# Altium schematic sheet Sheet_2.schdoc
size 404 x 275 mm
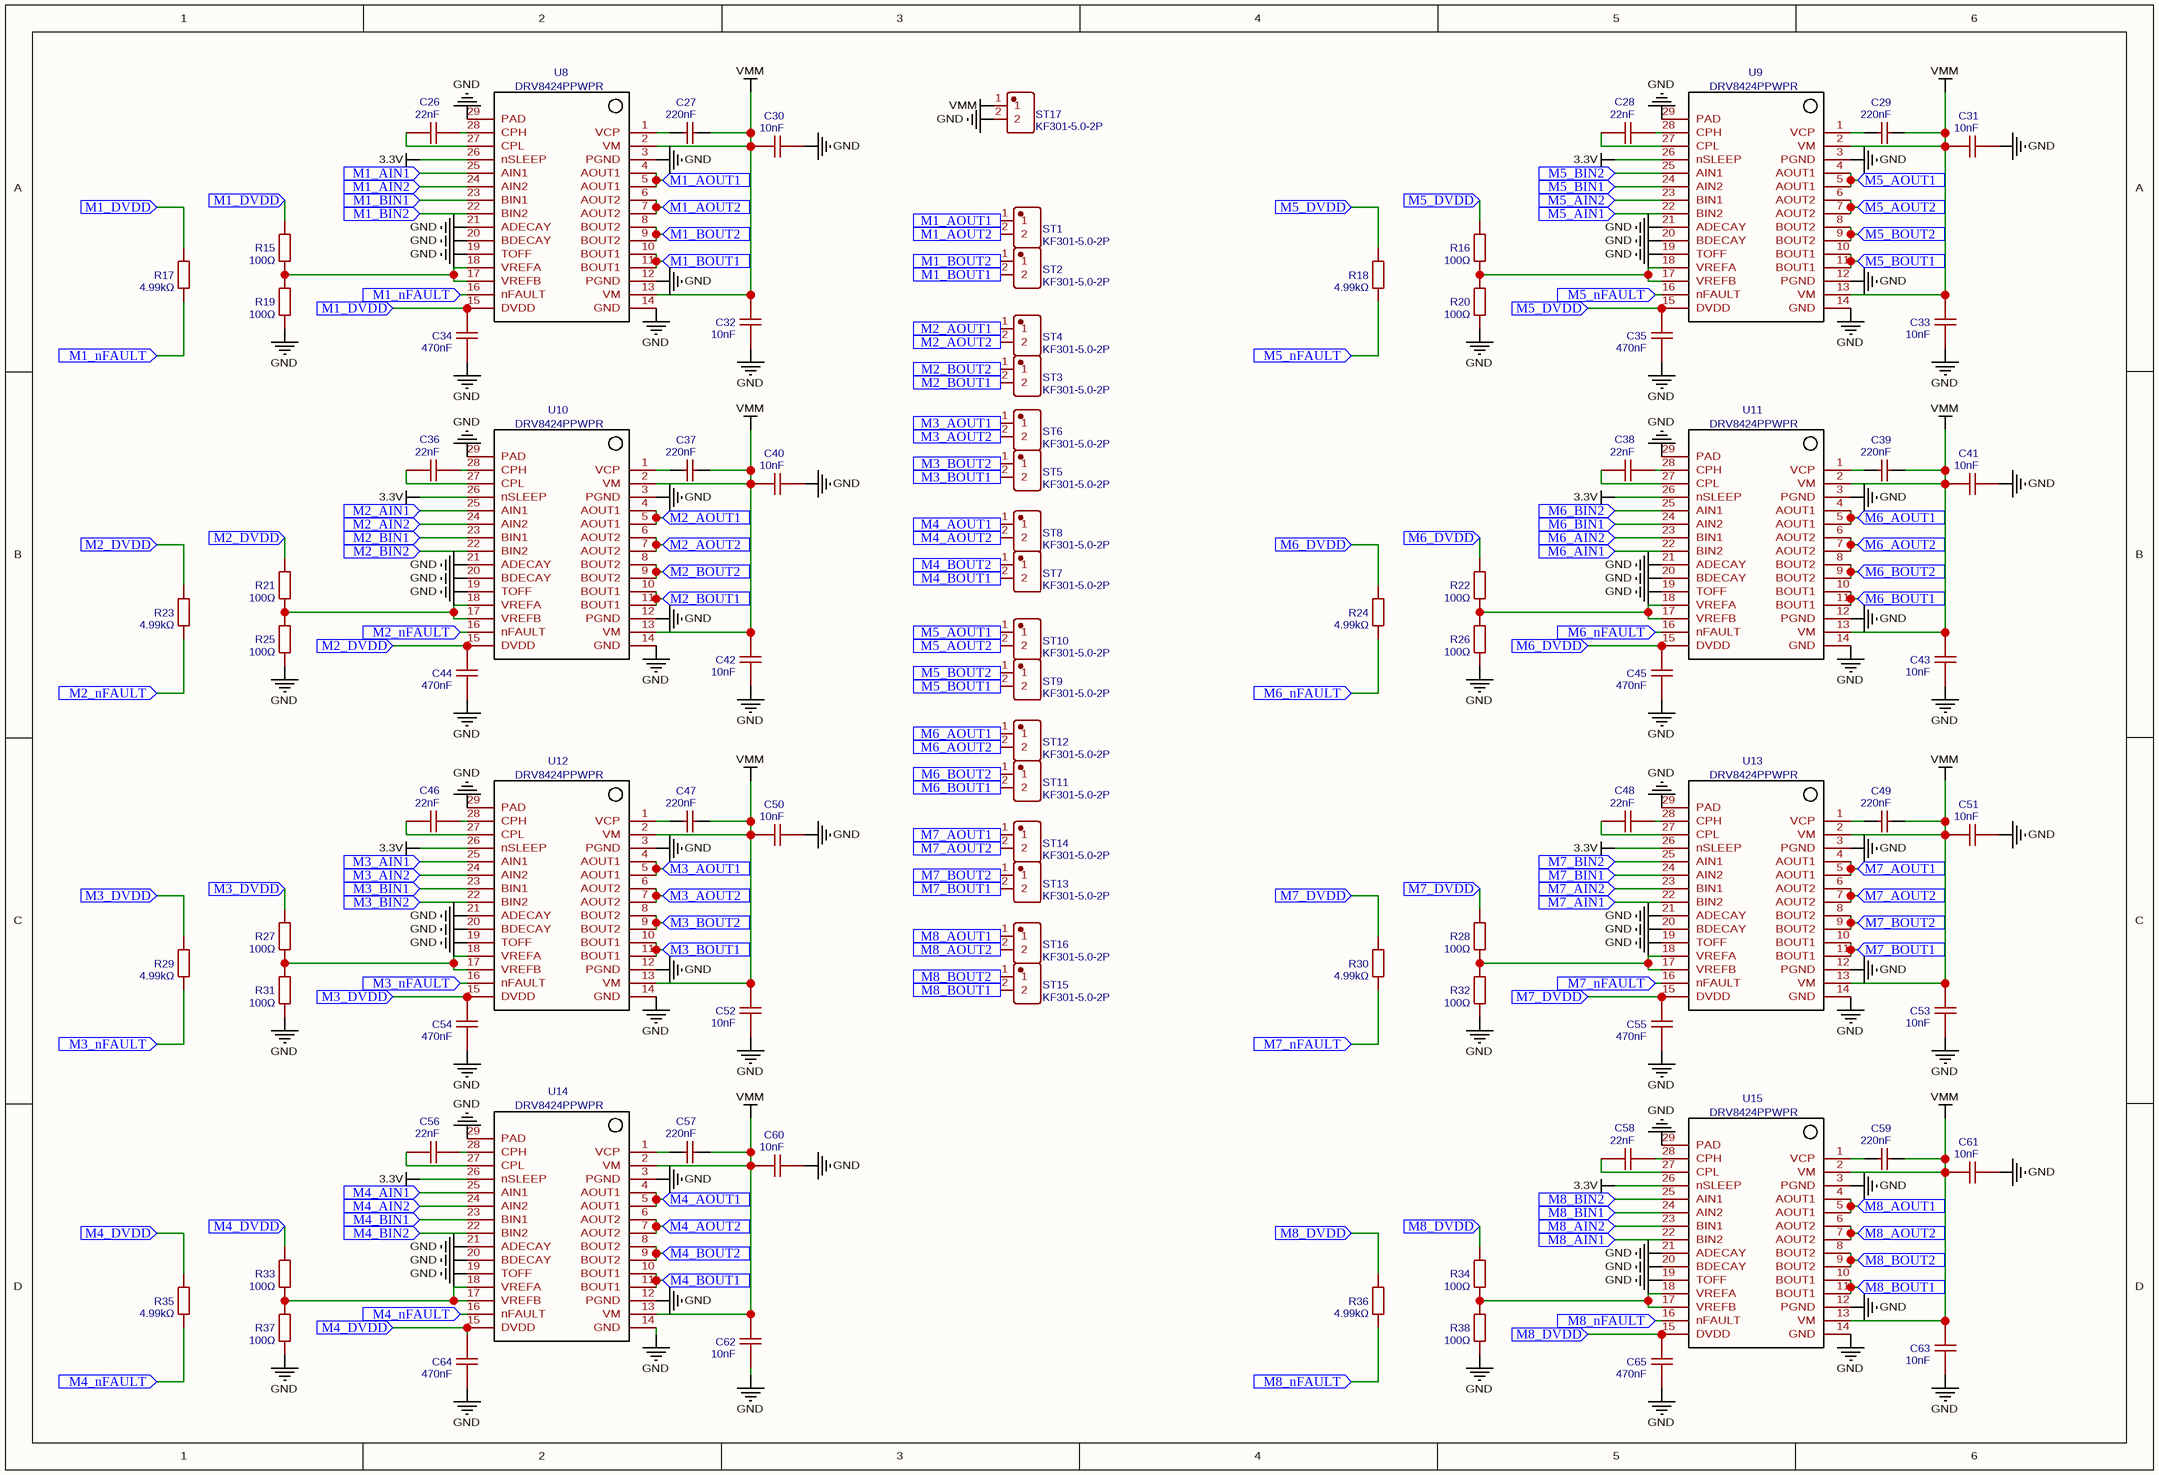
[diagram p0: Sheet_2.schdoc]

## Parts
C26  22nF  [C0805]
C27  220nF  [C0805]
C28  22nF  [C0805]
C29  220nF  [C0805]
C30  10nF  [C0805]
C31  10nF  [C0805]
C32  10nF  [C0805]
C33  10nF  [C0805]
C34  470nF  [C0805]
C35  470nF  [C0805]
C36  22nF  [C0805]
C37  220nF  [C0805]
C38  22nF  [C0805]
C39  220nF  [C0805]
C40  10nF  [C0805]
C41  10nF  [C0805]
C42  10nF  [C0805]
C43  10nF  [C0805]
C44  470nF  [C0805]
C45  470nF  [C0805]
C46  22nF  [C0805]
C47  220nF  [C0805]
C48  22nF  [C0805]
C49  220nF  [C0805]
C50  10nF  [C0805]
C51  10nF  [C0805]
C52  10nF  [C0805]
C53  10nF  [C0805]
C54  470nF  [C0805]
C55  470nF  [C0805]
C56  22nF  [C0805]
C57  220nF  [C0805]
C58  22nF  [C0805]
C59  220nF  [C0805]
C60  10nF  [C0805]
C61  10nF  [C0805]
C62  10nF  [C0805]
C63  10nF  [C0805]
C64  470nF  [C0805]
C65  470nF  [C0805]
R15  100Ω  [R0805]
R16  100Ω  [R0805]
R17  4.99kΩ  [R0805]
R18  4.99kΩ  [R0805]
R19  100Ω  [R0805]
R20  100Ω  [R0805]
R21  100Ω  [R0805]
R22  100Ω  [R0805]
R23  4.99kΩ  [R0805]
R24  4.99kΩ  [R0805]
R25  100Ω  [R0805]
R26  100Ω  [R0805]
R27  100Ω  [R0805]
R28  100Ω  [R0805]
R29  4.99kΩ  [R0805]
R30  4.99kΩ  [R0805]
R31  100Ω  [R0805]
R32  100Ω  [R0805]
R33  100Ω  [R0805]
R34  100Ω  [R0805]
R35  4.99kΩ  [R0805]
R36  4.99kΩ  [R0805]
R37  100Ω  [R0805]
R38  100Ω  [R0805]
ST1  KF301-5.0-2P  [CONN-TH_P5.00_KF301-5.0-2P]
ST2  KF301-5.0-2P  [CONN-TH_P5.00_KF301-5.0-2P]
ST3  KF301-5.0-2P  [CONN-TH_P5.00_KF301-5.0-2P]
ST4  KF301-5.0-2P  [CONN-TH_P5.00_KF301-5.0-2P]
ST5  KF301-5.0-2P  [CONN-TH_P5.00_KF301-5.0-2P]
ST6  KF301-5.0-2P  [CONN-TH_P5.00_KF301-5.0-2P]
ST7  KF301-5.0-2P  [CONN-TH_P5.00_KF301-5.0-2P]
ST8  KF301-5.0-2P  [CONN-TH_P5.00_KF301-5.0-2P]
ST9  KF301-5.0-2P  [CONN-TH_P5.00_KF301-5.0-2P]
ST10  KF301-5.0-2P  [CONN-TH_P5.00_KF301-5.0-2P]
ST11  KF301-5.0-2P  [CONN-TH_P5.00_KF301-5.0-2P]
ST12  KF301-5.0-2P  [CONN-TH_P5.00_KF301-5.0-2P]
ST13  KF301-5.0-2P  [CONN-TH_P5.00_KF301-5.0-2P]
ST14  KF301-5.0-2P  [CONN-TH_P5.00_KF301-5.0-2P]
ST15  KF301-5.0-2P  [CONN-TH_P5.00_KF301-5.0-2P]
ST16  KF301-5.0-2P  [CONN-TH_P5.00_KF301-5.0-2P]
ST17  KF301-5.0-2P  [CONN-TH_P5.00_KF301-5.0-2P]
U8  DRV8424PPWPR  [TSSOP_28_POWERPAD]
U9  DRV8424PPWPR  [TSSOP_28_POWERPAD]
U10  DRV8424PPWPR  [TSSOP_28_POWERPAD]
U11  DRV8424PPWPR  [TSSOP_28_POWERPAD]
U12  DRV8424PPWPR  [TSSOP_28_POWERPAD]
U13  DRV8424PPWPR  [TSSOP_28_POWERPAD]
U14  DRV8424PPWPR  [TSSOP_28_POWERPAD]
U15  DRV8424PPWPR  [TSSOP_28_POWERPAD]

## Ports
M1_AIN1 (in), M1_AIN2 (in), M1_AOUT1 (in), M1_AOUT2 (in), M1_BIN1 (in), M1_BIN2 (in), M1_BOUT1 (in), M1_BOUT2 (in), M1_DVDD (in), M1_nFAULT (in), M2_AIN1 (in), M2_AIN2 (in), M2_AOUT1 (in), M2_AOUT2 (in), M2_BIN1 (in), M2_BIN2 (in), M2_BOUT1 (in), M2_BOUT2 (in), M2_DVDD (in), M2_nFAULT (in), M3_AIN1 (in), M3_AIN2 (in), M3_AOUT1 (in), M3_AOUT2 (in), M3_BIN1 (in), M3_BIN2 (in), M3_BOUT1 (in), M3_BOUT2 (in), M3_DVDD (in), M3_nFAULT (in), M4_AIN1 (in), M4_AIN2 (in), M4_AOUT1 (in), M4_AOUT2 (in), M4_BIN1 (in), M4_BIN2 (in), M4_BOUT1 (in), M4_BOUT2 (in), M4_DVDD (in), M4_nFAULT (in), M5_AIN1 (in), M5_AIN2 (in), M5_AOUT1 (in), M5_AOUT2 (in), M5_BIN1 (in), M5_BIN2 (in), M5_BOUT1 (in), M5_BOUT2 (in), M5_DVDD (in), M5_nFAULT (in), M6_AIN1 (in), M6_AIN2 (in), M6_AOUT1 (in), M6_AOUT2 (in), M6_BIN1 (in), M6_BIN2 (in), M6_BOUT1 (in), M6_BOUT2 (in), M6_DVDD (in), M6_nFAULT (in), M7_AIN1 (in), M7_AIN2 (in), M7_AOUT1 (in), M7_AOUT2 (in), M7_BIN1 (in), M7_BIN2 (in), M7_BOUT1 (in), M7_BOUT2 (in), M7_DVDD (in), M7_nFAULT (in), M8_AIN1 (in), M8_AIN2 (in), M8_AOUT1 (in), M8_AOUT2 (in), M8_BIN1 (in), M8_BIN2 (in), M8_BOUT1 (in), M8_BOUT2 (in), M8_DVDD (in), M8_nFAULT (in)

## Nets
3.3V: U8.26(nSLEEP) U9.26(nSLEEP) U10.26(nSLEEP) U11.26(nSLEEP) U12.26(nSLEEP) U13.26(nSLEEP) U14.26(nSLEEP) U15.26(nSLEEP)
GND: C30.2 C31.2 C32.2 C33.2 C34.2 C35.2 C40.2 C41.2 C42.2 C43.2 C44.2 C45.2 C50.2 C51.2 C52.2 C53.2 C54.2 C55.2 C60.2 C61.2 C62.2 C63.2 C64.2 C65.2 R19.1 R20.1 R25.1 R26.1 R31.1 R32.1 R37.1 R38.1 ST17.2 U8.3(PGND) U8.12(PGND) U8.14(GND) U8.19(TOFF) U8.20(BDECAY) U8.21(ADECAY) U8.29(PAD) U9.3(PGND) U9.12(PGND) U9.14(GND) U9.19(TOFF) U9.20(BDECAY) U9.21(ADECAY) U9.29(PAD) U10.3(PGND) U10.12(PGND) U10.14(GND) U10.19(TOFF) U10.20(BDECAY) U10.21(ADECAY) U10.29(PAD) U11.3(PGND) U11.12(PGND) U11.14(GND) U11.19(TOFF) U11.20(BDECAY) U11.21(ADECAY) U11.29(PAD) U12.3(PGND) U12.12(PGND) U12.14(GND) U12.19(TOFF) U12.20(BDECAY) U12.21(ADECAY) U12.29(PAD) U13.3(PGND) U13.12(PGND) U13.14(GND) U13.19(TOFF) U13.20(BDECAY) U13.21(ADECAY) U13.29(PAD) U14.3(PGND) U14.12(PGND) U14.14(GND) U14.19(TOFF) U14.20(BDECAY) U14.21(ADECAY) U14.29(PAD) U15.3(PGND) U15.12(PGND) U15.14(GND) U15.19(TOFF) U15.20(BDECAY) U15.21(ADECAY) U15.29(PAD)
VMM: C27.1 C29.1 C30.1 C31.1 C32.1 C33.1 C37.1 C39.1 C40.1 C41.1 C42.1 C43.1 C47.1 C49.1 C50.1 C51.1 C52.1 C53.1 C57.1 C59.1 C60.1 C61.1 C62.1 C63.1 ST17.1 U8.2(VM) U8.13(VM) U9.2(VM) U9.13(VM) U10.2(VM) U10.13(VM) U11.2(VM) U11.13(VM) U12.2(VM) U12.13(VM) U13.2(VM) U13.13(VM) U14.2(VM) U14.13(VM) U15.2(VM) U15.13(VM)
M1_AIN1: U8.25(AIN1) ; port M1_AIN1
M1_AIN2: U8.24(AIN2) ; port M1_AIN2
M1_AOUT1: ST1.1 U8.4(AOUT1) U8.5(AOUT1) ; port M1_AOUT1
M1_AOUT2: ST1.2 U8.6(AOUT2) U8.7(AOUT2) ; port M1_AOUT2
M1_BIN1: U8.23(BIN1) ; port M1_BIN1
M1_BIN2: U8.22(BIN2) ; port M1_BIN2
M1_BOUT1: ST2.2 U8.10(BOUT1) U8.11(BOUT1) ; port M1_BOUT1
M1_BOUT2: ST2.1 U8.8(BOUT2) U8.9(BOUT2) ; port M1_BOUT2
M1_DVDD: C34.1 R15.2 R17.2 U8.15(DVDD) ; port M1_DVDD
M1_nFAULT: R17.1 U8.16(nFAULT) ; port M1_nFAULT
M2_AIN1: U10.25(AIN1) ; port M2_AIN1
M2_AIN2: U10.24(AIN2) ; port M2_AIN2
M2_AOUT1: ST4.1 U10.4(AOUT1) U10.5(AOUT1) ; port M2_AOUT1
M2_AOUT2: ST4.2 U10.6(AOUT2) U10.7(AOUT2) ; port M2_AOUT2
M2_BIN1: U10.23(BIN1) ; port M2_BIN1
M2_BIN2: U10.22(BIN2) ; port M2_BIN2
M2_BOUT1: ST3.2 U10.10(BOUT1) U10.11(BOUT1) ; port M2_BOUT1
M2_BOUT2: ST3.1 U10.8(BOUT2) U10.9(BOUT2) ; port M2_BOUT2
M2_DVDD: C44.1 R21.2 R23.2 U10.15(DVDD) ; port M2_DVDD
M2_nFAULT: R23.1 U10.16(nFAULT) ; port M2_nFAULT
M3_AIN1: U12.25(AIN1) ; port M3_AIN1
M3_AIN2: U12.24(AIN2) ; port M3_AIN2
M3_AOUT1: ST6.1 U12.4(AOUT1) U12.5(AOUT1) ; port M3_AOUT1
M3_AOUT2: ST6.2 U12.6(AOUT2) U12.7(AOUT2) ; port M3_AOUT2
M3_BIN1: U12.23(BIN1) ; port M3_BIN1
M3_BIN2: U12.22(BIN2) ; port M3_BIN2
M3_BOUT1: ST5.2 U12.10(BOUT1) U12.11(BOUT1) ; port M3_BOUT1
M3_BOUT2: ST5.1 U12.8(BOUT2) U12.9(BOUT2) ; port M3_BOUT2
M3_DVDD: C54.1 R27.2 R29.2 U12.15(DVDD) ; port M3_DVDD
M3_nFAULT: R29.1 U12.16(nFAULT) ; port M3_nFAULT
M4_AIN1: U14.25(AIN1) ; port M4_AIN1
M4_AIN2: U14.24(AIN2) ; port M4_AIN2
M4_AOUT1: ST8.1 U14.4(AOUT1) U14.5(AOUT1) ; port M4_AOUT1
M4_AOUT2: ST8.2 U14.6(AOUT2) U14.7(AOUT2) ; port M4_AOUT2
M4_BIN1: U14.23(BIN1) ; port M4_BIN1
M4_BIN2: U14.22(BIN2) ; port M4_BIN2
M4_BOUT1: ST7.2 U14.10(BOUT1) U14.11(BOUT1) ; port M4_BOUT1
M4_BOUT2: ST7.1 U14.8(BOUT2) U14.9(BOUT2) ; port M4_BOUT2
M4_DVDD: C64.1 R33.2 R35.2 U14.15(DVDD) ; port M4_DVDD
M4_nFAULT: R35.1 U14.16(nFAULT) ; port M4_nFAULT
M5_AIN1: U9.22(BIN2) ; port M5_AIN1
M5_AIN2: U9.23(BIN1) ; port M5_AIN2
M5_AOUT1: ST10.1 U9.4(AOUT1) U9.5(AOUT1) ; port M5_AOUT1
M5_AOUT2: ST10.2 U9.6(AOUT2) U9.7(AOUT2) ; port M5_AOUT2
M5_BIN1: U9.24(AIN2) ; port M5_BIN1
M5_BIN2: U9.25(AIN1) ; port M5_BIN2
M5_BOUT1: ST9.2 U9.10(BOUT1) U9.11(BOUT1) ; port M5_BOUT1
M5_BOUT2: ST9.1 U9.8(BOUT2) U9.9(BOUT2) ; port M5_BOUT2
M5_DVDD: C35.1 R16.2 R18.2 U9.15(DVDD) ; port M5_DVDD
M5_nFAULT: R18.1 U9.16(nFAULT) ; port M5_nFAULT
M6_AIN1: U11.22(BIN2) ; port M6_AIN1
M6_AIN2: U11.23(BIN1) ; port M6_AIN2
M6_AOUT1: ST12.1 U11.4(AOUT1) U11.5(AOUT1) ; port M6_AOUT1
M6_AOUT2: ST12.2 U11.6(AOUT2) U11.7(AOUT2) ; port M6_AOUT2
M6_BIN1: U11.24(AIN2) ; port M6_BIN1
M6_BIN2: U11.25(AIN1) ; port M6_BIN2
M6_BOUT1: ST11.2 U11.10(BOUT1) U11.11(BOUT1) ; port M6_BOUT1
M6_BOUT2: ST11.1 U11.8(BOUT2) U11.9(BOUT2) ; port M6_BOUT2
M6_DVDD: C45.1 R22.2 R24.2 U11.15(DVDD) ; port M6_DVDD
M6_nFAULT: R24.1 U11.16(nFAULT) ; port M6_nFAULT
M7_AIN1: U13.22(BIN2) ; port M7_AIN1
M7_AIN2: U13.23(BIN1) ; port M7_AIN2
M7_AOUT1: ST14.1 U13.4(AOUT1) U13.5(AOUT1) ; port M7_AOUT1
M7_AOUT2: ST14.2 U13.6(AOUT2) U13.7(AOUT2) ; port M7_AOUT2
M7_BIN1: U13.24(AIN2) ; port M7_BIN1
M7_BIN2: U13.25(AIN1) ; port M7_BIN2
M7_BOUT1: ST13.2 U13.10(BOUT1) U13.11(BOUT1) ; port M7_BOUT1
M7_BOUT2: ST13.1 U13.8(BOUT2) U13.9(BOUT2) ; port M7_BOUT2
M7_DVDD: C55.1 R28.2 R30.2 U13.15(DVDD) ; port M7_DVDD
M7_nFAULT: R30.1 U13.16(nFAULT) ; port M7_nFAULT
M8_AIN1: U15.22(BIN2) ; port M8_AIN1
M8_AIN2: U15.23(BIN1) ; port M8_AIN2
M8_AOUT1: ST16.1 U15.4(AOUT1) U15.5(AOUT1) ; port M8_AOUT1
M8_AOUT2: ST16.2 U15.6(AOUT2) U15.7(AOUT2) ; port M8_AOUT2
M8_BIN1: U15.24(AIN2) ; port M8_BIN1
M8_BIN2: U15.25(AIN1) ; port M8_BIN2
M8_BOUT1: ST15.2 U15.10(BOUT1) U15.11(BOUT1) ; port M8_BOUT1
M8_BOUT2: ST15.1 U15.8(BOUT2) U15.9(BOUT2) ; port M8_BOUT2
M8_DVDD: C65.1 R34.2 R36.2 U15.15(DVDD) ; port M8_DVDD
M8_nFAULT: R36.1 U15.16(nFAULT) ; port M8_nFAULT
NetC26_1: C26.1 U8.28(CPH)
NetC26_2: C26.2 U8.27(CPL)
NetC27_2: C27.2 U8.1(VCP)
NetC28_1: C28.1 U9.28(CPH)
NetC28_2: C28.2 U9.27(CPL)
NetC29_2: C29.2 U9.1(VCP)
NetC36_1: C36.1 U10.28(CPH)
NetC36_2: C36.2 U10.27(CPL)
NetC37_2: C37.2 U10.1(VCP)
NetC38_1: C38.1 U11.28(CPH)
NetC38_2: C38.2 U11.27(CPL)
NetC39_2: C39.2 U11.1(VCP)
NetC46_1: C46.1 U12.28(CPH)
NetC46_2: C46.2 U12.27(CPL)
NetC47_2: C47.2 U12.1(VCP)
NetC48_1: C48.1 U13.28(CPH)
NetC48_2: C48.2 U13.27(CPL)
NetC49_2: C49.2 U13.1(VCP)
NetC56_1: C56.1 U14.28(CPH)
NetC56_2: C56.2 U14.27(CPL)
NetC57_2: C57.2 U14.1(VCP)
NetC58_1: C58.1 U15.28(CPH)
NetC58_2: C58.2 U15.27(CPL)
NetC59_2: C59.2 U15.1(VCP)
NetR15_1: R15.1 R19.2 U8.17(VREFB) U8.18(VREFA)
NetR16_1: R16.1 R20.2 U9.17(VREFB) U9.18(VREFA)
NetR21_1: R21.1 R25.2 U10.17(VREFB) U10.18(VREFA)
NetR22_1: R22.1 R26.2 U11.17(VREFB) U11.18(VREFA)
NetR27_1: R27.1 R31.2 U12.17(VREFB) U12.18(VREFA)
NetR28_1: R28.1 R32.2 U13.17(VREFB) U13.18(VREFA)
NetR33_1: R33.1 R37.2 U14.17(VREFB) U14.18(VREFA)
NetR34_1: R34.1 R38.2 U15.17(VREFB) U15.18(VREFA)

## Library data of the parts
C26 C28 C36 C38 C46 C48 C56 C58 = 22nF: BOM_Manufacturer: KEMET; BOM_Manufacturer Part: C0805C223K1RACAUTO; nameAlias: Capacitance; Contributor: LCSC; BOM_Supplier: LCSC; BOM_Supplier Part: C561834; BOM_JLCPCB Part Class: Extended Part; spicePre: C; spiceSymbolName: C0805C223K1RACAUTO
C27 C29 C37 C39 C47 C49 C57 C59 = 220nF: BOM_Manufacturer: YAGEO; BOM_Manufacturer Part: CC0805KRX7R8BB224; nameAlias: Capacitance; BOM_Supplier: LCSC; BOM_Supplier Part: C107139; BOM_JLCPCB Part Class: Extended Part; spicePre: C; spiceSymbolName: CC0805KRX7R8BB224
C30-C33 C40-C43 C50-C53 C60-C63 = 10nF: BOM_Manufacturer: YAGEO; BOM_Manufacturer Part: CC0805KRX7R9BB103; nameAlias: Capacitance; BOM_Supplier: LCSC; BOM_Supplier Part: C83170; BOM_JLCPCB Part Class: Extended Part; spicePre: C; spiceSymbolName: CC0805KRX7R9BB103
C34 C35 C44 C45 C54 C55 C64 C65 = 470nF: BOM_Manufacturer: YAGEO; BOM_Manufacturer Part: CC0805JKX7R7BB474; nameAlias: Capacitance; Contributor: LCSC; BOM_Supplier: LCSC; BOM_Supplier Part: C520079; spicePre: C; spiceSymbolName: CC0805JKX7R7BB474
R15 R16 R19-R22 R25-R28 R31-R34 R37 R38 = 100Ω: BOM_Manufacturer: Ever Ohms Tech; BOM_Manufacturer Part: QR0805J100RP05; Resistance (Ohms): 100; nameAlias: Resistance; Contributor: LCSC; BOM_Supplier: LCSC; BOM_Supplier Part: C176206; BOM_JLCPCB Part Class: Extended Part; spicePre: R; spiceSymbolName: QR0805J100RP05
R17 R18 R23 R24 R29 R30 R35 R36 = 4.99kΩ: BOM_Manufacturer: Tyohm; BOM_Manufacturer Part: RMC08054.99K1%N; Resistance (Ohms): 4.99K; nameAlias: Resistance; Contributor: LCSC; BOM_Supplier: LCSC; BOM_Supplier Part: C325814; BOM_JLCPCB Part Class: Extended Part; spicePre: R; spiceSymbolName: RMC08054.99K1%N
ST1-ST17 = KF301-5.0-2P: BOM_Manufacturer: Cixi Kefa Elec; Contributor: LCSC; BOM_Supplier: LCSC; BOM_Supplier Part: C474881; BOM_Manufacturer Part: KF301-5.0-2P; BOM_JLCPCB Part Class: Extended Part; spicePre: U; spiceSymbolName: KF301-5.0-2P
U8-U15 = DRV8424PPWPR: Contributor: 吳東燁; spicePre: U; spiceSymbolName: DRV8424PPWPR